# Altium schematic sheet Cyusb3014 - 3.SchDoc
size A3
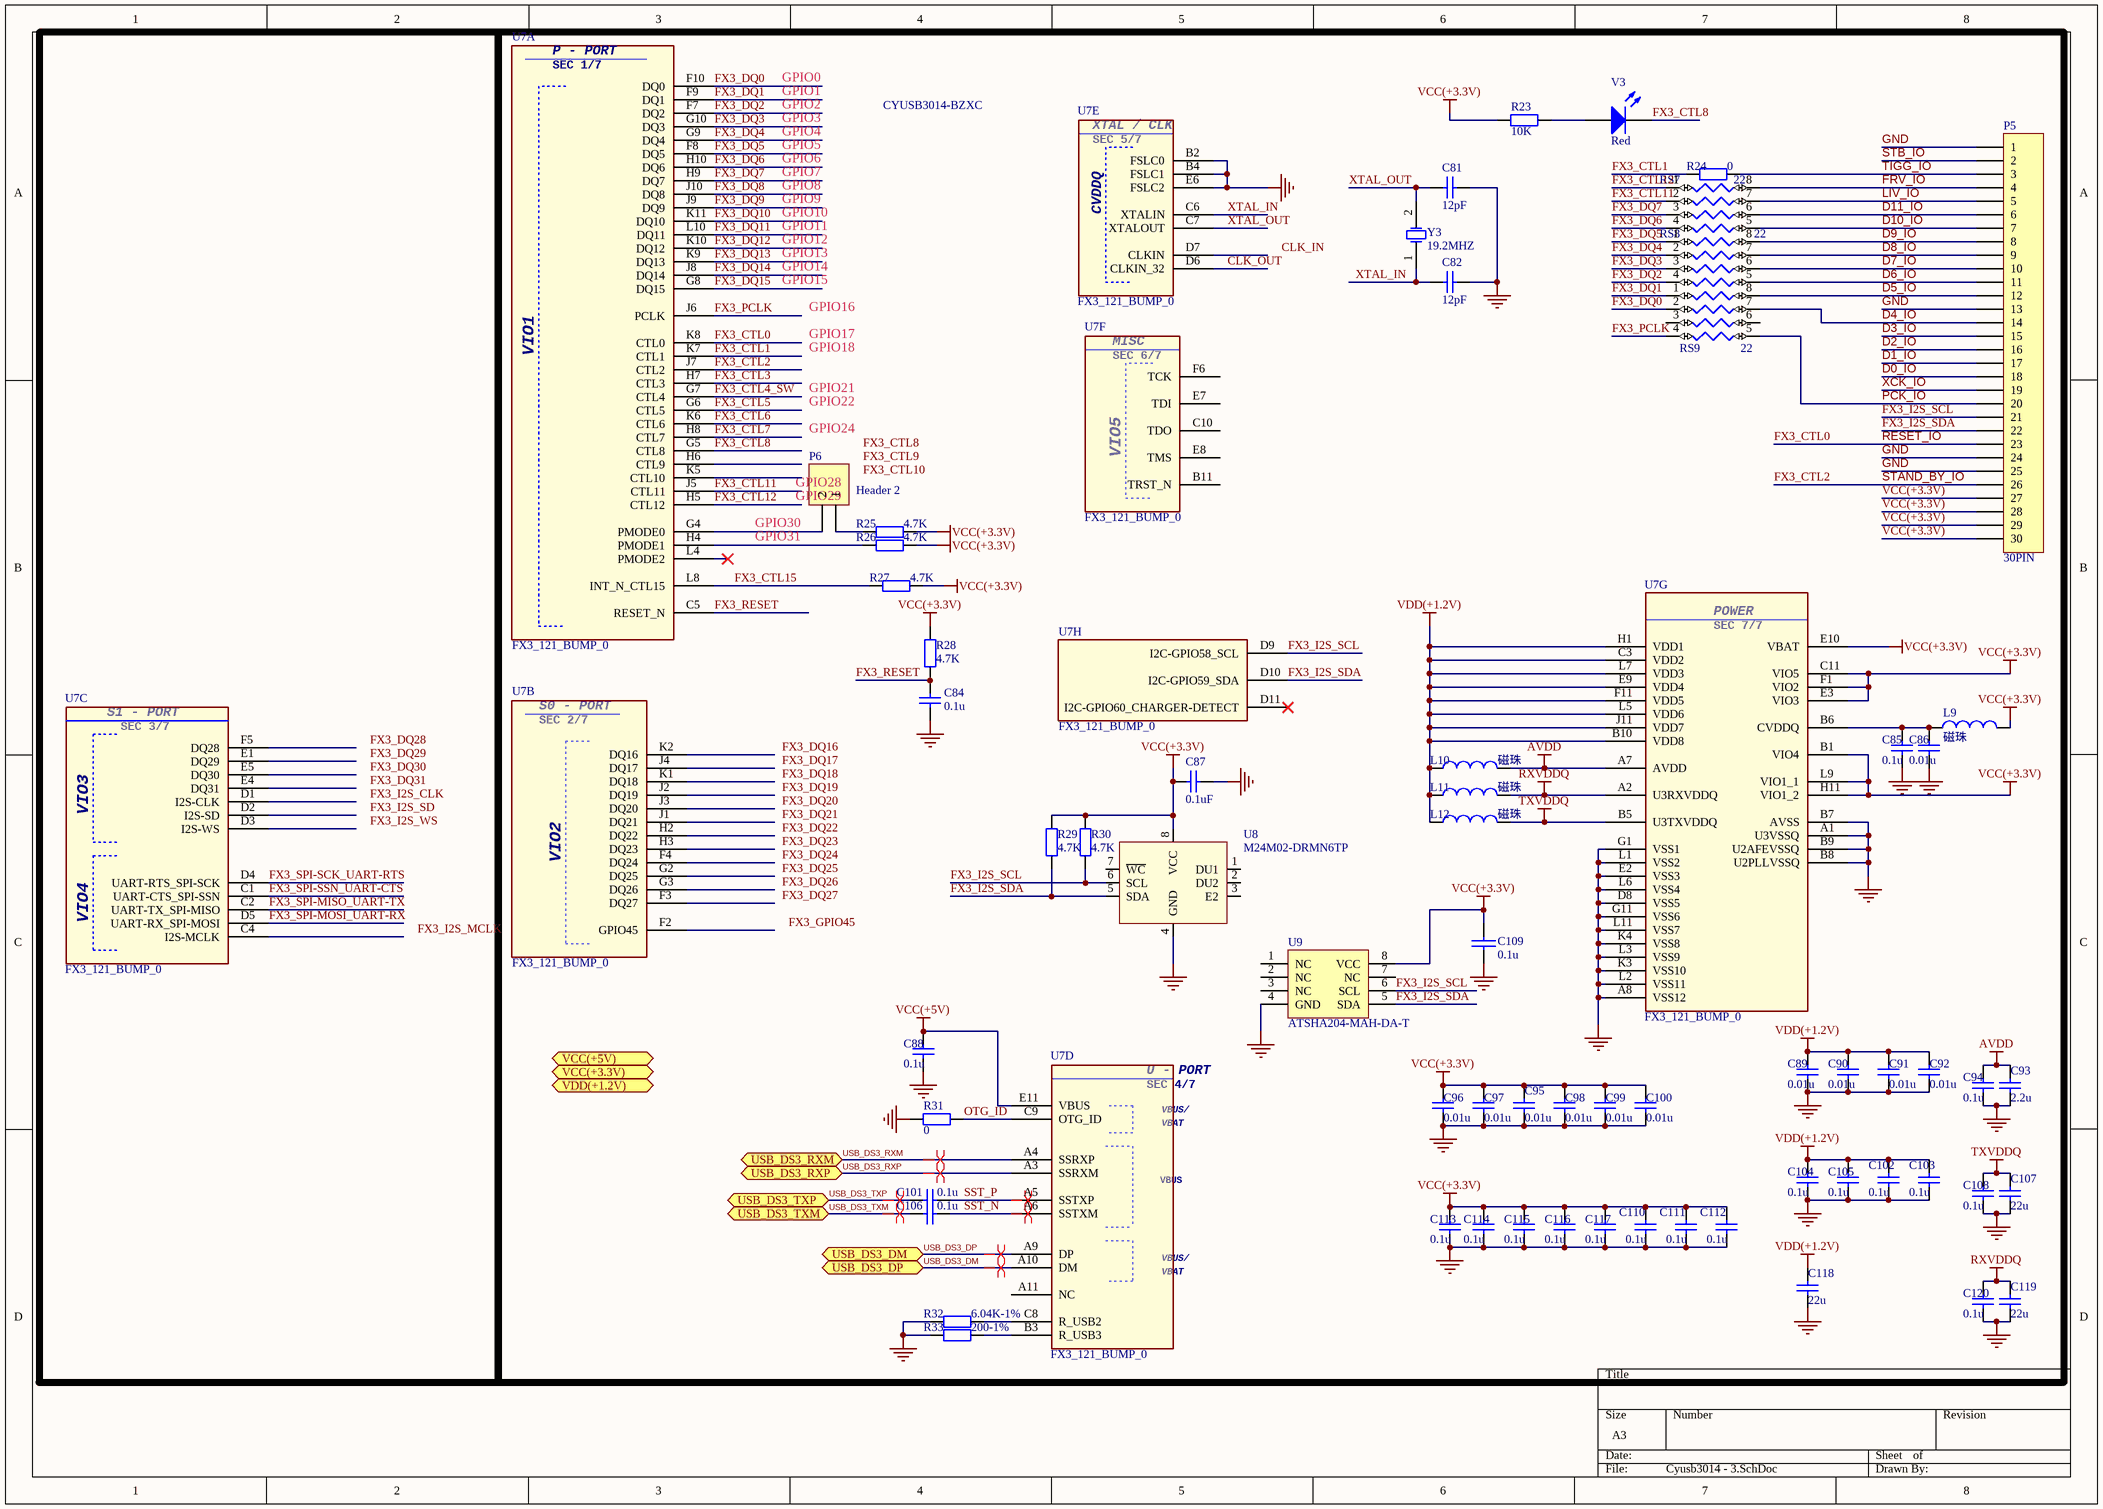
[diagram p0: Cyusb3014 - 3.SchDoc]

## Parts
C81  12pF  [0603S-CAP]
C82  12pF  [0603S-CAP]
C84  0.1u  [0603S-CAP]
C85  0.1u  [C0402]
C86  0.01u  [C0402]
C87  0.1uF  [0603S-CAP]
C88  0.1u  [C0402]
C89  0.01u  [C0402]
C90  0.01u  [C0402]
C91  0.01u  [C0402]
C92  0.01u  [C0402]
C93  2.2u  [C0805S-CAP]
C94  0.1u  [C0402]
C95  0.01u  [C0402]
C96  0.01u  [C0402]
C97  0.01u  [C0402]
C98  0.01u  [C0402]
C99  0.01u  [C0402]
C100  0.01u  [C0402]
C101  0.1u  [C0402]
C102  0.1u  [C0402]
C103  0.1u  [C0402]
C104  0.1u  [C0402]
C105  0.1u  [C0402]
C106  0.1u  [C0402]
C107  22u  [C0805S-CAP]
C108  0.1u  [C0402]
C109  0.1u  [0603S-CAP]
C110  0.1u  [C0402]
C111  0.1u  [C0402]
C112  0.1u  [C0402]
C113  0.1u  [C0402]
C114  0.1u  [C0402]
C115  0.1u  [C0402]
C116  0.1u  [C0402]
C117  0.1u  [C0402]
C118  22u  [C0805S-CAP]
C119  22u  [C0805S-CAP]
C120  0.1u  [C0402]
L9  磁珠  [L0603]
L10  磁珠  [L0603]
L11  磁珠  [L0603]
L12  磁珠  [L0603]
P5  30PIN  [FH12-30S-0.5SH]
P6  Header 2  [HDR1X2]
R23  10K  [0603S-RES]
R24  0  [0603S-RES]
R25  4.7K  [0603S-RES]
R26  4.7K  [0603S-RES]
R27  4.7K  [0603S-RES]
R28  4.7K  [0603S-RES]
R29  4.7K  [0603S-RES]
R30  4.7K  [0603S-RES]
R31  0  [0603S-RES]
R32  6.04K-1%  [0603S-RES]
R33  200-1%  [0603S-RES]
RS7  22  [NC06-4]
RS8  22  [NC06-4]
RS9  22  [NC06-4]
U7  FX3_121_BUMP_0  [121_BGA_FX3]  (parts A,B,C,D,E,F,G,H of 8)
U8  M24M02-DRMN6TP  [SOIC127P600X175-8N]
U9  ATSHA204-MAH-DA-T  [UDFN]
V3  Red  [LED0805S]
Y3  19.2MHZ  [爱普生晶振3.2×2.5MM - 无源]

## Ports
USB_DS3_DM (bidir), USB_DS3_DP (bidir), USB_DS3_RXM (bidir), USB_DS3_RXP (bidir), USB_DS3_TXM (bidir), USB_DS3_TXP (bidir), VCC(+3.3V) (bidir), VCC(+5V) (bidir), VDD(+1.2V) (bidir)

## Nets
AVDD: C93.2 C94.1 L10.2 U7.A7(AVDD)
GND: C81.1 C82.1 C84.1 C85.2 C86.2 C87.1 C88.2 C89.2 C90.2 C91.2 C92.2 C93.1 C94.2 C95.2 C96.2 C97.2 C98.2 C99.2 C100.2 C102.2 C103.2 C104.2 C105.2 C107.1 C108.2 C109.2 C110.2 C111.2 C112.2 C113.2 C114.2 C115.2 C116.2 C117.2 C118.1 C119.1 C120.2 P5.1 P5.13 P5.24 P5.25 R31.2 R32.2 R33.2 U7.A1(U3VSSQ) U7.A8(VSS12) U7.B2(FSLC0) U7.B4(FSLC1) U7.B7(AVSS) U7.B8(U2PLLVSSQ) U7.B9(U2AFEVSSQ) U7.D8(VSS5) U7.E2(VSS3) U7.E6(FSLC2) U7.G1(VSS1) U7.G11(VSS6) U7.K3(VSS10) U7.K4(VSS8) U7.L1(VSS2) U7.L2(VSS11) U7.L3(VSS9) U7.L6(VSS4) U7.L11(VSS7) U8.4(GND) U9.4(GND)
RXVDDQ: C119.2 C120.1 L11.2 U7.A2(U3RXVDDQ)
TXVDDQ: C107.2 C108.1 L12.2 U7.B5(U3TXVDDQ)
VCC(+3.3V): C87.2 C95.1 C96.1 C97.1 C98.1 C99.1 C100.1 C109.1 C110.1 C111.1 C112.1 C113.1 C114.1 C115.1 C116.1 C117.1 L9.2 P5.27 P5.28 P5.29 P5.30 R23.2 R25.2 R26.2 R27.1 R28.1 R29.2 R30.2 U7.B1(VIO4) U7.C11(VIO5) U7.E3(VIO3) U7.E10(VBAT) U7.F1(VIO2) U7.H11(VIO1_2) U7.L9(VIO1_1) U8.8(VCC) U9.8(VCC)
VCC(+5V): C88.1 U7.E11(VBUS)
VDD(+1.2V): C89.1 C90.1 C91.1 C92.1 C102.1 C103.1 C104.1 C105.1 C118.2 L10.1 L11.1 L12.1 U7.B10(VDD8) U7.C3(VDD2) U7.E9(VDD4) U7.F11(VDD5) U7.H1(VDD1) U7.J11(VDD7) U7.L5(VDD6) U7.L7(VDD3)
CLK_OUT: U7.D6(CLKIN_32)
D0_IO: P5.18
D1_IO: P5.17
D2_IO: P5.16
D3_IO: P5.15
D4_IO: P5.14 RS9.7
D5_IO: P5.12 RS9.8
D6_IO: P5.11 RS8.5
D7_IO: P5.10 RS8.6
D8_IO: P5.9 RS8.7
D9_IO: P5.8 RS8.8
D10_IO: P5.7 RS7.5
D11_IO: P5.6 RS7.6
FRV_IO: P5.4 RS7.8
FX3_CTL0: P5.23 U7.K8(CTL0)  [also labelled RESET_IO]
FX3_CTL1: R24.2 U7.K7(CTL1)
FX3_CTL2: P5.26 U7.J7(CTL2)  [also labelled STAND_BY_IO]
FX3_CTL3: U7.H7(CTL3)
FX3_CTL4_SW: U7.G7(CTL4)
FX3_CTL5: U7.G6(CTL5)
FX3_CTL6: U7.K6(CTL6)
FX3_CTL7: U7.H8(CTL7)
FX3_CTL8: U7.G5(CTL8) V3.2(K)
FX3_CTL11: RS7.2 U7.J5(CTL11)
FX3_CTL12: RS7.1 U7.H5(CTL12)
FX3_CTL15: R27.2 U7.L8(INT_N_CTL15)
FX3_DQ0: RS9.2 U7.F10(DQ0)
FX3_DQ1: RS9.1 U7.F9(DQ1)
FX3_DQ2: RS8.4 U7.F7(DQ2)
FX3_DQ3: RS8.3 U7.G10(DQ3)
FX3_DQ4: RS8.2 U7.G9(DQ4)
FX3_DQ5: RS8.1 U7.F8(DQ5)
FX3_DQ6: RS7.4 U7.H10(DQ6)
FX3_DQ7: RS7.3 U7.H9(DQ7)
FX3_DQ8: U7.J10(DQ8)
FX3_DQ9: U7.J9(DQ9)
FX3_DQ10: U7.K11(DQ10)
FX3_DQ11: U7.L10(DQ11)
FX3_DQ12: U7.K10(DQ12)
FX3_DQ13: U7.K9(DQ13)
FX3_DQ14: U7.J8(DQ14)
FX3_DQ15: U7.G8(DQ15)
FX3_I2S_SCL: P5.21 R30.1 U7.D9(I2C-GPIO58_SCL) U8.6(SCL) U9.6(SCL)
FX3_I2S_SDA: P5.22 R29.1 U7.D10(I2C-GPIO59_SDA) U8.5(SDA) U9.5(SDA)
FX3_PCLK: RS9.4 U7.J6(PCLK)
FX3_RESET: C84.2 R28.2 U7.C5(RESET_N)
FX3_SPI-MISO_UART-TX: U7.C2(UART-TX_SPI-MISO)
FX3_SPI-MOSI_UART-RX: U7.D5(UART-RX_SPI-MOSI)
FX3_SPI-SCK_UART-RTS: U7.D4(UART-RTS_SPI-SCK)
FX3_SPI-SSN_UART-CTS: U7.C1(UART-CTS_SPI-SSN)
LIV_IO: P5.5 RS7.7
OTG_ID: R31.1 U7.C9(OTG_ID)
PCK_IO: P5.20 RS9.5
SST_N: C106.2 U7.A6(SSTXM)
SST_P: C101.2 U7.A5(SSTXP)
STB_IO: P5.2
TIGG_IO: P5.3 R24.1
USB_DS3_DM: U7.A10(DM) ; port USB_DS3_DP
USB_DS3_DP: U7.A9(DP) ; port USB_DS3_DM
USB_DS3_RXM: U7.A4(SSRXP) ; port USB_DS3_RXM
USB_DS3_RXP: U7.A3(SSRXM) ; port USB_DS3_RXP
USB_DS3_TXM: C106.1 ; port USB_DS3_TXM
USB_DS3_TXP: C101.1 ; port USB_DS3_TXP
XCK_IO: P5.19
XTAL_IN: C82.2 U7.C6(XTALIN) Y3.1(OSC1)
XTAL_OUT: C81.2 U7.C7(XTALOUT) Y3.2(OSC2)
NetC85_1: C85.1 C86.1 L9.1 U7.B6(CVDDQ)
NetP6_1: P6.1 R25.1
NetP6_2: P6.2 U7.G4(PMODE0)
NetR23_1: R23.1 V3.1(A)
NetR26_1: R26.1 U7.H4(PMODE1)
NetR32_1: R32.1 U7.C8(R_USB2)
NetR33_1: R33.1 U7.B3(R_USB3)

Not connected (* = marked no-connect by the designer): RS9 3 6; U7 A11(NC) B11(TRST_N) C4(I2S-MCLK) C10(TDO) D1(I2S-CLK) D2(I2S-SD) D3(I2S-WS) D7(CLKIN) D11(I2C-GPIO60_CHARGER-DETECT)* E1(DQ29) E4(DQ31) E5(DQ30) E7(TDI) E8(TMS) F2(GPIO45) F3(DQ27) F4(DQ24) F5(DQ28) F6(TCK) G2(DQ25) G3(DQ26) H2(DQ22) H3(DQ23) H6(CTL9) J1(DQ21) J2(DQ19) J3(DQ20) J4(DQ17) K1(DQ18) K2(DQ16) K5(CTL10) L4(PMODE2)*; U8 1(DU1) 2(DU2) 3(E2) 7(~{WC}); U9 1(NC) 2(NC) 3(NC) 7(NC)

## Layout directives
differential pair: SST_N, SST_P, USB_DS3_DM, USB_DS3_DP, USB_DS3_RXM, USB_DS3_RXP, USB_DS3_TXM, USB_DS3_TXP

## Notes on the sheet
- GPIO0
- GPIO1
- GPIO2
- CYUSB3014-BZXC
- GPIO3
- GPIO4
- GPIO5
- GPIO6
- GPIO7
- GPIO8
- GPIO9
- GPIO10
- GPIO11
- GPIO12
- GPIO13
- GPIO14
- GPIO15
- GPIO16
- GPIO17
- GPIO18
- GPIO21
- GPIO22
- GPIO24
- (near P6) GPIO28
- (near P6) GPIO29
- (near P6) GPIO30
- (near P6) GPIO31
- Labels drawn without touching a wire or pin: CLK_IN, FX3_CTL8, FX3_CTL9, FX3_CTL10, FX3_DQ16, FX3_DQ17, FX3_DQ18, FX3_DQ19, FX3_DQ20, FX3_DQ21, FX3_DQ22, FX3_DQ23, FX3_DQ24, FX3_DQ25, FX3_DQ26, FX3_DQ27, FX3_DQ28, FX3_DQ29, FX3_DQ30, FX3_DQ31, FX3_GPIO45, FX3_I2S_CLK, FX3_I2S_MCLK, FX3_I2S_SD, FX3_I2S_WS
- (in symbol FX3_121_BUMP_0, part A) P - PORT; SEC 1/7; VIO1
- (in symbol FX3_121_BUMP_0, part B) S0 - PORT; SEC 2/7
- (in symbol FX3_121_BUMP_0, part C) S1 - PORT; SEC 3/7
- (in symbol FX3_121_BUMP_0, part D) U - PORT; SEC 4/7; VBUS/
- (in symbol FX3_121_BUMP_0, part E) XTAL / CLK; SEC 5/7
- (in symbol FX3_121_BUMP_0, part F) MISC; SEC 6/7
- (in symbol FX3_121_BUMP_0, part G) POWER; SEC 7/7

## Library data of the parts
C81 C82 = CAP CER SMT 4.3pF 0805: 2. Manufacturere Part Number: C0805C439D5GACTU; 1. Manufacturer: Kemet; 8. Alternate Part: any; 7. Package / Case: 0805; 0. Do Not Install: DNI; 6. Mounting Type: SMT; 5. Supplier Link: http://www.digikey.com/product-detail/en/C0805C439D5GACTU/C0805C439D5GACTU-ND/2212763; 3. Supplier: Digi-Key; 4. Supplier Part Number: C0805C439D5GACTU-ND
C84 = Cap: 50V/8.2u/0805; Value: 100n; Published: 8-Jun-2000; LatestRevisionDate: 17-Jul-2002; LatestRevisionNote: Re-released for DXP Platform.; PackageReference: RAD-0.3; Publisher: Altium Limited
C85 C86 C88-C108 C110-C120 = CAP0805: Capacitor; Value: 104; Published: 8-Jun-2000; Revision: July-2002: Re-released for DXP Platform.; Publisher: Altium Limited
C87 = CAP SMT 0.1uF 16V X7R: 2. Manufacturere Part Number: C0805C104K4RACTU; 1. Manufacturer: Kemet; 8. Alternate Part: any; 7. Package / Case: 0805; 6. Mounting Type: SMT; 5. Supplier Link: http://www.digikey.com/product-detail/en/C0805C104K4RACTU/399-1167-1-ND/411442; 3. Supplier: Digi-Key; 4. Supplier Part Number: 399-1167-1-ND
C109 = CAP: RC=1206
L9-L12 = Inductor: Code_IEC: 1005; Value: 10mH; Published: 8-Jun-2000; LatestRevisionDate: 29-May-2009; LatestRevisionNote: IPC-7351 Footprint Added.; PackageReference: 0402-A; Publisher: Altium Limited; PackageDescription: Chip Inductor; Code_JEITA: 0402
P5 = Header 30: Header, 30-Pin; LatestRevisionDate: 17-Jul-2002; LatestRevisionNote: Re-released for DXP Platform.; Publisher: Altium Limited
P6 = Header 2: Header, 2-Pin; LatestRevisionDate: 17-Jul-2002; LatestRevisionNote: Re-released for DXP Platform.; Publisher: Altium Limited
R23 = Res2: Resistor; Published: 8-Jun-2000; LatestRevisionDate: 17-Jul-2002; LatestRevisionNote: Re-released for DXP Platform.; PackageReference: AXIAL-0.4; Publisher: Altium Limited; Value: 10K
R24-R33 = Res2: Resistor; Value: 10K; Published: 8-Jun-2000; LatestRevisionDate: 17-Jul-2002; LatestRevisionNote: Re-released for DXP Platform.; PackageReference: AXIAL-0.4; Publisher: Altium Limited
RS7-RS9 = RN4: Option 2 - Device: *; Option 2 - Spec: *; Option 3 - Device: *; Option 3 - Spec: *; Option 4 - Device: *; Option 4 - Spec: *; Option 5 - Device: *; Option 5 - Spec: *; Option 6 - Device: *; Option 6 - Spec: *; Option 7 - Device: *; Option 7 - Spec: *; Option 8 - Device: *; Option 8 - Spec: *
U8 = 24LC64-I/SN: IC EEPROM 64KBIT 400KHZ 8SOIC; Manufacturer: Microchip Technology; Format - Memory: EEPROMs - Serial; Memory Size: 64K (8K x 8); Interface: I2C, 2-Wire Serial; Voltage - Supply: 2.5 V ~ 5.5 V; Supplier 1: Digi-Key; Manufacturer Part Number: 24LC64-I/SN; RoHS: RoHS Compliant; Category: Integrated Circuits (ICs); Stock 1: 16323; Pricing 1: 1=0.38, 25=0.37, 100=0.35 (USD); Packaging: Tube; Memory Type: EEPROM; Speed: 400kHz; Operating Temperature: -40°C ~ 85°C (TA); Package / Case: 8-SOIC (0.154", 3.90mm Width); Supplier Device Package: 8-SOIC; ComponentLink1URL: http://www.microchip.com/mymicrochip/filehandler.aspx?ddocname=en011843; ComponentLink1Description: http://www.microchip.com/mymicrochip/filehandler.aspx?ddocname=en011843; Supplier Part Number 1: 24LC64-I/SN-ND
U9 = AT24C128
V3 = LED0: Typical INFRARED GaAs LED; Published: 8-Jun-2000; LatestRevisionDate: 08-Jul-2005; LatestRevisionNote: Mech Layer 1 removed.; PackageReference: LED-0; Publisher: Altium Limited
Y3 = XTAL 32.768KHZ: Crystal, CRYSTAL 32.768KHZ 6PF SMD; 2. Manufacturere Part Number: ABS07-120-32.768KHZ-T; 1. Manufacturer: Abracon; 6. Mounting Type: SMT; 9. Notes: 2 pad - Abracon ABS07-120-32.768KHZ-T, 4 pad - Abracon ABS25-32.768KHZ-6-T; 0. Do Not Install: DNI; 5. Supplier Link: http://www.digikey.com/product-detail/en/ABS07-120-32.768KHZ-T/535-11937-1-ND/3724046; 3. Supplier: Digi-Key; 4. Supplier Part Number: 535-11937-1-ND